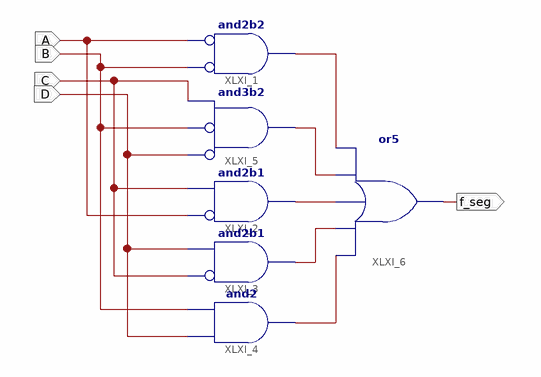
[diagram p0: schematic sheet 1]
// Xilinx ISE schematic bcd4to7f.sch (spartan6) as structural Verilog: 6 symbols, 5 ports
module bcd4to7f (
  input  A,
  input  B,
  input  C,
  input  D,
  output f_seg
);

  wire XLXN_1, XLXN_2, XLXN_3, XLXN_4, XLXN_5;

  and XLXI_1 (XLXN_1, ~B, ~A);  // and2b2
  and XLXI_2 (XLXN_3, ~A, C);  // and2b1
  and XLXI_3 (XLXN_4, ~C, D);  // and2b1
  and XLXI_4 (XLXN_5, D, B);
  and XLXI_5 (XLXN_2, ~D, ~B, C);  // and3b2
  or XLXI_6 (f_seg, XLXN_5, XLXN_4, XLXN_3, XLXN_2, XLXN_1);
endmodule
